# Altium schematic sheet Interface.SchDoc
size A
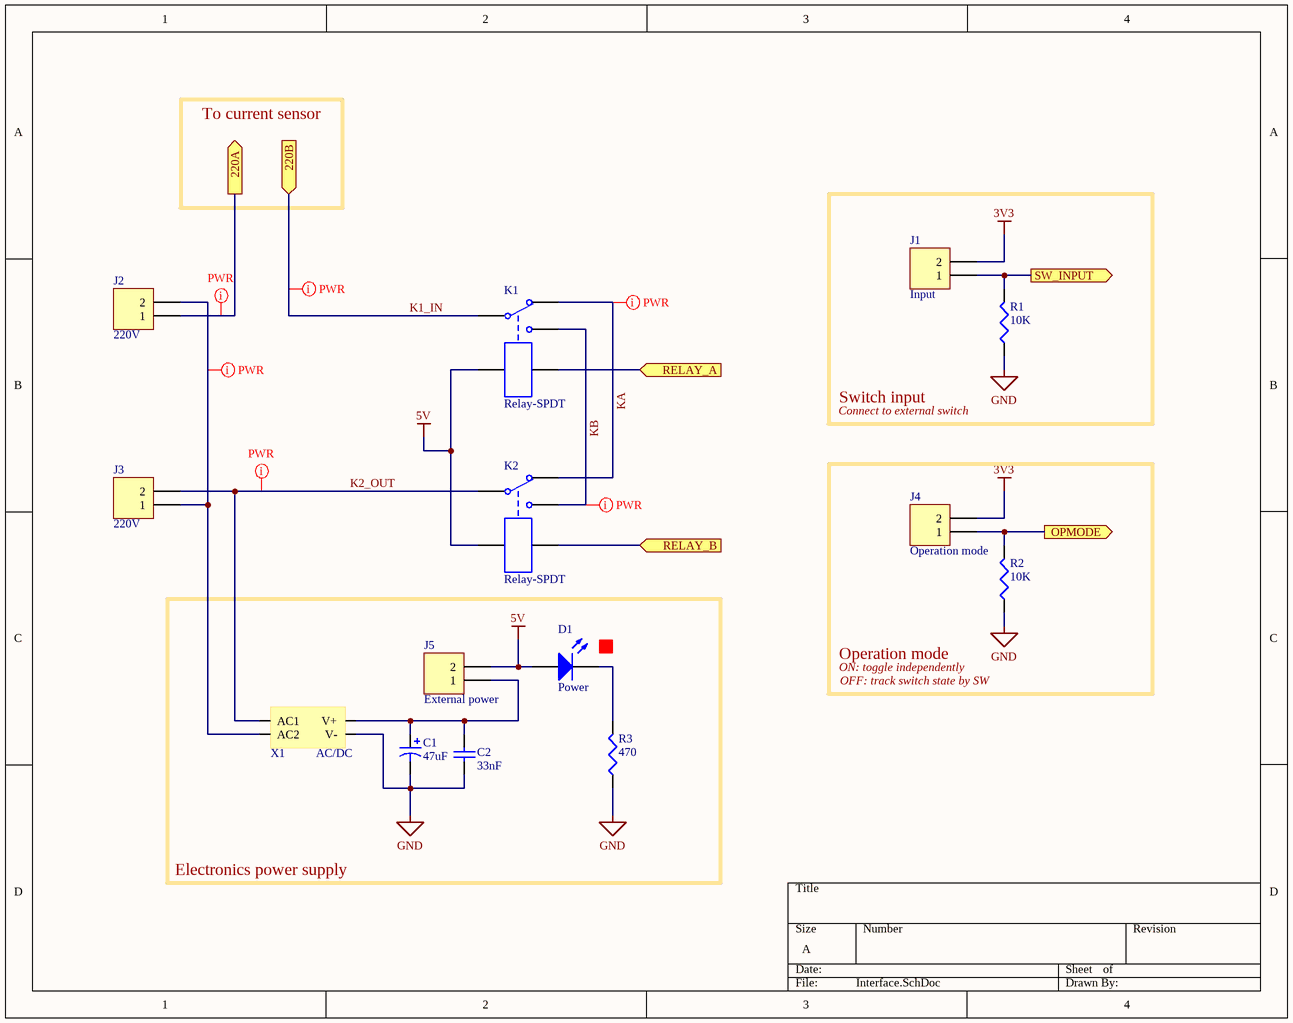
[diagram p0: Interface.SchDoc]

## Parts
C1  value 47uF  [CAP47U]  (hidden comment: Cap Pol1)
C2  value 33nF  [C0805]  (hidden comment: Cap)
D1  Power  [3.2X1.6X1.1]
J1  Input  [TBLOCK2]
J2  220V  [TBLOCK2]
J3  220V  [TBLOCK2]
J4  Operation mode  [HEADER2]
J5  External power  [HEADER2]
K1  Relay-SPDT  [G5LE-1C]
K2  Relay-SPDT  [G5LE-1C]
R1  value 10K  [J1-0603]  (hidden comment: Res3)
R2  value 10K  [J1-0603]  (hidden comment: Res3)
R3  value 470  [J1-0603]  (hidden comment: Res3)
X1  AC/DC  [HLK-PM01]

## Blocks framed on the sheet
Switch input: J1 R1
Operation mode: J4 R2
Electronics power supply: C1 C2 D1 J5 R3 X1

## Ports
220A (out), 220B (in), OPMODE (out), RELAY_A (in), RELAY_B (in), SW_INPUT (out)

## Nets
3V3: J1.2 J4.2
5V: D1.1(A) J5.2 K1.4 K2.4
GND: C1.2 C2.1 R1.1 R2.1 R3.1 X1.3(V-)
220A: J2.1 ; port 220A
K1_IN: K1.1 ; port 220B
K2_OUT: J3.2 K2.1 X1.1(AC1)
KA: K1.2 K2.2
KB: K1.3 K2.3
OPMODE: J4.1 R2.2 ; port OPMODE
RELAY_A: K1.5 ; port RELAY_A
RELAY_B: K2.5 ; port RELAY_B
SW_INPUT: J1.1 R1.2 ; port SW_INPUT
NetC1_1: C1.1 C2.2 J5.1 X1.4(V+)
NetD1_2: D1.2(K) R3.2
NetJ2_2: J2.2 J3.1 X1.2(AC2)

## Layout directives
net class power: 220A, K1_IN, K2_OUT, KA, KB, NetJ2_2

## Notes on the sheet
- To current sensor
- Connect to external switch
- ON: toggle independently
- OFF: track switch state by SW

## Library data of the parts
C1 = Cap Pol1: Polarized Capacitor (Radial); Manufacturer 1: Nichicon; Manufacturer Part Number 1: UWT1E470MCL6GS; Description 1: Aluminum Electrolytic Capacitors - SMD 25volts 47uF 6.3x5.8 20%; Dielectric Material: Aluminium; Voltage Rating: 25V; Tolerance: 20%; Ripple Current: 59mA; Leakage Current: 3uA; Life (Hours): 1000Hour; Dissipation Factor: 0.16%; Published: 8-Jun-2000; LatestRevisionDate: 17-Jul-2002; LatestRevisionNote: Re-released for DXP Platform.; PackageReference: RB7.6-15; Publisher: Altium Limited; PackageDescription: Polarized Capacitor (Radial); 2 Leads; Supplier 1: Digi-Key; Supplier Part Number 1: 493-9881-6-ND; Stock: 12722; Pricing 1: 1=0.29, 10=0.202, 100=0.1143, 500=0.08072 (USD); Mount: Surface Mount; Case/Package: Radial; Min Operating Temperature: -55°C; Max Operating Temperature: 105°C; Capacitance: 47uF; Package Quantity: 1000; Voltage Rating (DC): 25V; Packaging: Tape and Reel; Termination: SMD/SMT; Features: General Purpose; Diameter: 6.3mm; Length: 5.8mm; Height: 6.6mm; Radiation Hardening: No; Lead Free: Lead Free; ComponentLink1URL: http://www.mouser.com/ds/2/293/e-wt-30307.pdf?src-supplier=Mouser; ComponentLink1Description: http://www.mouser.com/ds/2/293/e-wt-30307.pdf?src-supplier=Mouser; ComponentLink2URL: https://www.verical.com/server-webapp/html/getDatasheet?partID=732041&src-supplier=Verical; ComponentLink2Description: https://www.verical.com/server-webapp/html/getDatasheet?partID=732041&src-supplier=Verical; ComponentLink3URL: http://www.nichicon.co.jp/english/products/pdfs/e-ch_ref.pdf?src-supplier=Digi-Key; ComponentLink3Description: http://www.nichicon.co.jp/english/products/pdfs/e-ch_ref.pdf?src-supplier=Digi-Key; ComponentLink4URL: http://nichicon-us.com/english/products/pdfs/e-wt.pdf?src-supplier=Future+Electronics; ComponentLink4Description: http://nichicon-us.com/english/products/pdfs/e-wt.pdf?src-supplier=Future+Electronics; ComponentLink5URL: http://www.nichicon.co.jp/english/products/pdfs/e-wt.pdf?src-supplier=Avnet+Europe; ComponentLink5Description: http://www.nichicon.co.jp/english/products/pdfs/e-wt.pdf?src-supplier=Avnet+Europe
C2 = Cap: Capacitor; Manufacturer 1: KEMET; Manufacturer Part Number 1: C0805C333K5RACTU; Description 1: KEMET - C0805C333K5RACTU - SMD Multilayer Ceramic Capacitor, 33000 pF, 50 V, 0805 [2012 Metric], ± 10%, X7R, C Series KEMET; Dielectric Material: Ceramic; Tolerance: 10%; Dielectric: X7R; Voltage Rating (DC): 50V; Published: 8-Jun-2000; LatestRevisionDate: 17-Jul-2002; LatestRevisionNote: Re-released for DXP Platform.; PackageReference: RAD-0.3; Publisher: Altium Limited; PackageDescription: Radial Cap, Thru-Hole; 2 Leads; 0.3 in Pin Spacing; Supplier 1: Digi-Key; Supplier Part Number 1: 399-1165-6-ND; Stock: 116403; Pricing 1: 1=0.12, 10=0.087, 100=0.0407, 500=0.02856, 1000=0.02364 (USD); Mount: Surface Mount; Case/Package: 0805; Min Operating Temperature: -55°C; Max Operating Temperature: 125°C; Capacitance: 33nF; Packaging: Tape and Reel; Voltage: 50V; Termination: SMD/SMT; Length: 2mm; Height: 0.78mm; Depth: 1.25mm; Radiation Hardening: No; ComponentLink1URL: http://www.kemet.com/kemet/web/homepage/kechome.nsf/vapubfiles/KEM_C1002_X7R_SMD.pdf/$file/KEM_C1002_X7R_SMD.pdf?src-supplier=Element14; ComponentLink1Description: http://www.kemet.com/kemet/web/homepage/kechome.nsf/vapubfiles/KEM_C1002_X7R_SMD.pdf/$file/KEM_C1002_X7R_SMD.pdf?src-supplier=Element14; ComponentLink2URL: http://www.onlinecomponents.com/productFiles/mf-KEM/kem_c1002_x7r_smd.pdf?src-supplier=Onlinecomponents.com; ComponentLink2Description: http://www.onlinecomponents.com/productFiles/mf-KEM/kem_c1002_x7r_smd.pdf?src-supplier=Onlinecomponents.com
D1 = LED2: Typical RED, GREEN, YELLOW, AMBER GaAs LED; Manufacturer 1: Stanley; Manufacturer Part Number 1: PG1101W-TR; Description 1: LED GREEN CLEAR 3216 SMD; Lens Style: Clear; Forward Voltage: 2.1V; Viewing Angle: 137°; Wavelength: 560nm; Luminous Intensity: 4.8mcd; Published: 8-Jun-2000; LatestRevisionDate: 17-Jul-2002; LatestRevisionNote: Re-released for DXP Platform.; PackageVersion: Feb-2002; PackageReference: 3.2X1.6X1.1; Publisher: Altium Limited; PackageDescription: SM LED; 2 Flat Leads; Supplier 1: Digi-Key; Supplier Part Number 1: 404-1046-6-ND; Stock: 64799; Pricing 1: 1=0.45, 10=0.316, 100=0.1841, 500=0.12624, 1000=0.1052 (USD); Mount: Surface Mount; Case/Package: 1206; Color: Green; Packaging: Cut Tape; Length: 3mm; Height: 1.5mm; Width: 1.5mm; Lead Free: Lead Free; ComponentLink1URL: http://www1.futureelectronics.com/doc/STANLEY/PG1101W-TR.pdf?src-supplier=Future+Electronics; ComponentLink1Description: http://www1.futureelectronics.com/doc/STANLEY/PG1101W-TR.pdf?src-supplier=Future+Electronics
J1-J3 = Header 2: Header, 2-Pin; Manufacturer 1: TE Connectivity; Manufacturer Part Number 1: 282834-2; Description 1: TE CONNECTIVITY / BUCHANAN - 282834-2 - TERMINAL BLOCK, WIRE TO BRD, 2POS, 16AWG; Plating: Brass,Steel; Max Voltage Rating (AC): 150V; Number of Poles: 2; Gender: Male; Current Rating: 10A; Number of Levels: 1; Connector Type: Receptacle; Closed End: No (Without); Screwless Terminal Block: Yes (With); Wire Gauge (Max): 30AWG; Pitch: 2.54mm; Thread Size: M1.6; Tail Length: 3.4mm; Approvals: UL; LatestRevisionDate: 17-Jul-2002; LatestRevisionNote: Re-released for DXP Platform.; Publisher: Altium Limited; Supplier 1: Digi-Key; Supplier Part Number 1: A98333-ND; Stock: 18918; Pricing 1: 1=0.92, 10=0.649, 25=0.6048, 50=0.549, 100=0.5467, 250=0.46164, 500=0.43732, 1000=0.38874, 5000=0.36444 (USD); Mount: Through Hole; Contact Plating: Tin; Contact Material: Brass; Color: Green; Material: Nylon; Housing Color: Green; Housing Material: Polyamide; Min Operating Temperature: -40°C; Max Operating Temperature: 105°C; Number of Rows: 1; Voltage Rating: 150V; Package Quantity: 300; Packaging: Bulk; Number of Positions: 2; Termination: Solder; Number of Positions Per Level: 2; Current: 10A; Voltage: 150V; Max Supply Voltage (AC): 150V; Number of Contacts: 2; Number of Circuits: 2; Orientation: Straight; Max Current Rating: 10A; Interlock: No (Without); Screw Flange: No (Without); Side Stackable: Yes (With); Length: 5.54mm; Wire Gauge (Min): 30AWG; Width: 6.5mm; Wire/Cable Gauge: 30AWG; Depth: 6.5mm; Radiation Hardening: No; REACH SVHC: Unknown; ELV: Compliant; Lead Free: Lead Free; Flammability Rating: UL94 V-0; ComponentLink1URL: https://www.alliedelec.com/m/d/020b790adaa0bc8636bbfa0190e2b719.pdf?src-supplier=Allied+Electronics; ComponentLink1Description: https://www.alliedelec.com/m/d/020b790adaa0bc8636bbfa0190e2b719.pdf?src-supplier=Allied+Electronics; ComponentLink2URL: https://www.verical.com/server-webapp/html/getDatasheet?partID=155864&src-supplier=Verical; ComponentLink2Description: https://www.verical.com/server-webapp/html/getDatasheet?partID=155864&src-supplier=Verical; ComponentLink3URL: http://www.te.com/commerce/DocumentDelivery/DDEController?Action=showdoc&DocId=Catalog+Section%7F1308389_EUROSTYLE_TERMINAL_BLOCKS%7F0607%7Fpdf%7FEnglish%7FENG_CS_1308389_EUROSTYLE_TERMINAL_BLOCKS_0607.pdf&src-supplier=Avnet; ComponentLink3Description: http://www.te.com/commerce/DocumentDelivery/DDEController?Action=showdoc&DocId=Catalog+Section%7F1308389_EUROSTYLE_TERMINAL_BLOCKS%7F0607%7Fpdf%7FEnglish%7FENG_CS_1308389_EUROSTYLE_TERMINAL_BLOCKS_0607.pdf&src-supplier=Avnet; ComponentLink4URL: http://www1.futureelectronics.com/doc/TE%20CONNECTIVITY/282834-2.pdf?src-supplier=Future+Electronics; ComponentLink4Description: http://www1.futureelectronics.com/doc/TE%20CONNECTIVITY/282834-2.pdf?src-supplier=Future+Electronics; ComponentLink5URL: https://www.te.com/commerce/DocumentDelivery/DDEController?Action=srchrtrv&DocNm=1308389_EUROSTYLE_TERMINAL_BLOCKS&DocType=CS&DocLang=English&src-supplier=Digi-Key; ComponentLink5Description: https://www.te.com/commerce/DocumentDelivery/DDEController?Action=srchrtrv&DocNm=1308389_EUROSTYLE_TERMINAL_BLOCKS&DocType=CS&DocLang=English&src-supplier=Digi-Key; ComponentLink6URL: http://www.te.com/commerce/DocumentDelivery/DDEController?Action=showdoc&DocId=Catalog+Section%7F1308389_EUROSTYLE_TERMINAL_BLOCKS%7F0607%7Fpdf%7FEnglish%7FENG_CS_1308389_EUROSTYLE_TERMINAL_BLOCKS_0607.pdf&src-supplier=Avnet+Europe; ComponentLink6Description: http://www.te.com/commerce/DocumentDelivery/DDEController?Action=showdoc&DocId=Catalog+Section%7F1308389_EUROSTYLE_TERMINAL_BLOCKS%7F0607%7Fpdf%7FEnglish%7FENG_CS_1308389_EUROSTYLE_TERMINAL_BLOCKS_0607.pdf&src-supplier=Avnet+Europe; ComponentLink7URL: http://www.onlinecomponents.com/productFiles/mf-AMP/eng_cs_1308389_eurostyle_terminal_blocks_0607.pdf?src-supplier=Onlinecomponents.com; ComponentLink7Description: http://www.onlinecomponents.com/productFiles/mf-AMP/eng_cs_1308389_eurostyle_terminal_blocks_0607.pdf?src-supplier=Onlinecomponents.com
J4 J5 = Header 2: Header, 2-Pin; Manufacturer 1: Amphenol FCI; Manufacturer Part Number 1: 77311-118-02LF; Description 1: Conn;  Rect;  UnshroudedHdr;  2Cnts;  ThruHole;  BergStik;  2.54mmPin-Spng;  Vert;  SingleRow; Current Rating: 3A; Voltage Rating: 1.5kV; Number of Positions: 2; Insulation Resistance: 5GR; Gender: Male; Connector Type: Male Pin; Pitch: 2.54mm; Contact Post Length: 3.05mm; LatestRevisionDate: 17-Jul-2002; LatestRevisionNote: Re-released for DXP Platform.; Publisher: Altium Limited; Supplier 1: Digi-Key; Supplier Part Number 1: 609-4434-ND; Stock: 85355; Pricing 1: 1=0.19, 10=0.182, 100=0.1258, 500=0.10648, 1000=0.08712, 5000=0.07744, 10000=0.07018 (USD); Mount: Through Hole; Contact Plating: Gold,GXT; Contact Material: Bronze; Color: Black; Housing Color: Black; Material: Thermoplastic; Housing Material: Thermoplastic; Min Operating Temperature: -65°C; Max Operating Temperature: 125°C; Number of Rows: 1; Contact Gender: Male; Package Quantity: 1000; Packaging: Bulk; Termination: Solder; Number of Contacts: 2; Max Voltage Rating (AC): 1.5kV; Orientation: Straight; Length: 5.08mm; Contact Mating Length: 0.23inch; Depth: 2.4mm; Radiation Hardening: No; REACH SVHC: No SVHC; Lead Free: Lead Free; Flammability Rating: UL94 V-0; ComponentLink1URL: https://cdn.amphenol-icc.com/media/wysiwyg/files/drawing/77311.pdf?src-supplier=Digi-Key; ComponentLink1Description: https://cdn.amphenol-icc.com/media/wysiwyg/files/drawing/77311.pdf?src-supplier=Digi-Key; ComponentLink2URL: http://portal.fciconnect.com/Comergent/fci/drawing/77311.pdf?src-supplier=Avnet+Asia; ComponentLink2Description: http://portal.fciconnect.com/Comergent/fci/drawing/77311.pdf?src-supplier=Avnet+Asia; ComponentLink3URL: http://portal.fciconnect.com/Comergent/fci/drawing/77311.pdf?src-supplier=Avnet; ComponentLink3Description: http://portal.fciconnect.com/Comergent/fci/drawing/77311.pdf?src-supplier=Avnet; ComponentLink4URL: https://www.alliedelec.com/m/d/695616ca3fa695a35268331f95f01020.pdf?src-supplier=Allied+Electronics; ComponentLink4Description: https://www.alliedelec.com/m/d/695616ca3fa695a35268331f95f01020.pdf?src-supplier=Allied+Electronics
K1 K2 = Relay-SPDT: Single-Pole Dual-Throw Relay; Manufacturer 1: Omron; Manufacturer Part Number 1: G5LE-14-DC3; Description 1: RELAY GEN PURPOSE SPDT 10A 3V; Throw Configuration: SPDT; Coil Resistance: 22.5R; Coil Current: 133mA; Operate Time: 10ms; Release Time: 5ms; Coil Power: 400mW; Max Voltage Rating (AC): 250V; Max Voltage Rating (DC): 125V; Relay Type: General Purpose; Coil Type: Non-Latching; Coil Voltage (DC): 3V; Contact Current Rating: 10A; Published: 24-Mar-1999; LatestRevisionDate: 17-Jul-2002; LatestRevisionNote: Re-released for DXP Platform.; PackageReference: MODULE5B; Publisher: Altium Limited; Supplier 1: Digi-Key; Supplier Part Number 1: Z3326-ND; Stock: 12824; Pricing 1: 1=1.44, 10=1.35, 25=1.2004, 50=1.1404, 100=1.0804, 250=0.96032, 500=0.9003, 1000=0.84028, 5000=0.81027 (USD); Mount: Through Hole; Number of Pins: 5; Weight: 12g; Contact Material: Tin,Silver; Min Operating Temperature: -25°C; Max Operating Temperature: 85°C; Package Quantity: 500; Packaging: Tray; Termination: PC Pin; Max Current Rating: 10A; Radiation Hardening: No; ComponentLink1URL: https://omronfs.omron.com/en_US/ecb/products/pdf/en-g5le.pdf?src-supplier=Digi-Key; ComponentLink1Description: https://omronfs.omron.com/en_US/ecb/products/pdf/en-g5le.pdf?src-supplier=Digi-Key
R1 R2 = Res3: Resistor; Manufacturer 1: Panasonic; Manufacturer Part Number 1: ERJ-3GEYJ103V; Description 1: Res Thick Film 0603 10K Ohm 5% 1/10W ±200ppm/°C Molded SMD Punched Carrier T/R; Resistance: 10kR; Tolerance: 5%; Power Rating: 100mW; Voltage Rating: 75V; Temperature Coefficient: 200ppm/°C; Voltage Rating (DC): 50V; Published: 8-Jun-2000; LatestRevisionDate: 29-May-2009; LatestRevisionNote: IPC-7351 Footprint Added.; PackageReference: J1-0603; Publisher: Altium Limited; PackageDescription: Chip Resistor; Supplier 1: Digi-Key; Supplier Part Number 1: P10KGDKR-ND; Stock: 22255773; Pricing 1: 1=0.1, 10=0.038, 100=0.0156, 1000=0.007, 2500=0.00607 (USD); Mount: Surface Mount; Case/Package: 0603; Weight: 7.1E-05oz; Case Code (Imperial): 0603; Case Code (Metric): 1608; Contact Plating: Tin; Min Operating Temperature: -55°C; Max Operating Temperature: 155°C; Packaging: Tape and Reel; Package Quantity: 1; Composition: Thick Film; Termination: SMD/SMT; Number of Terminations: 2; Military Standard: Not; Max Power Dissipation: 100mW; Working Voltage: 75V; Features: Automotive AEC-Q200; Length: 1.6mm; Height: 0.45mm; Width: 0.8mm; Depth: 0.8mm; REACH SVHC: No SVHC; Lead Free: Lead Free; ComponentLink1URL: http://www.farnell.com/datasheets/2059623.pdf?src-supplier=Element14; ComponentLink1Description: http://www.farnell.com/datasheets/2059623.pdf?src-supplier=Element14; ComponentLink2URL: http://industrial.panasonic.com/www-cgi/jvcr13pz.cgi?E+PZ+3+AOA0002+ERJ1GNJ120C+7+WW?src-supplier=Mouser; ComponentLink2Description: http://industrial.panasonic.com/www-cgi/jvcr13pz.cgi?E+PZ+3+AOA0002+ERJ1GNJ120C+7+WW?src-supplier=Mouser; ComponentLink3URL: http://industrial.panasonic.com/www-data/pdf/AOA0000/AOA0000CE1.pdf?src-supplier=Avnet+Europe; ComponentLink3Description: http://industrial.panasonic.com/www-data/pdf/AOA0000/AOA0000CE1.pdf?src-supplier=Avnet+Europe; ComponentLink4URL: http://www.jameco.com/Jameco/Products/ProdDS/2007265.pdf?src-supplier=Jameco; ComponentLink4Description: http://www.jameco.com/Jameco/Products/ProdDS/2007265.pdf?src-supplier=Jameco; ComponentLink5URL: http://industrial.panasonic.com/www-data/pdf/AOA0000/AOA0000CE1.pdf?src-supplier=Avnet; ComponentLink5Description: http://industrial.panasonic.com/www-data/pdf/AOA0000/AOA0000CE1.pdf?src-supplier=Avnet; ComponentLink6URL: https://industrial.panasonic.com/cdbs/www-data/pdf/RDA0000/AOA0000C301.pdf?src-supplier=Future+Electronics; ComponentLink6Description: https://industrial.panasonic.com/cdbs/www-data/pdf/RDA0000/AOA0000C301.pdf?src-supplier=Future+Electronics
R3 = Res3: Resistor; Manufacturer 1: TE Connectivity; Manufacturer Part Number 1: CRGCQ0603J470R; Description 1: TE CONNECTIVITY - CRGCQ0603J470R - RES, 470R, 5%, 0603, THICK FILM; Resistance: 470R; Tolerance: 5%; Max Power Dissipation: 100mW; Temperature Coefficient: 100ppm/°C; Published: 8-Jun-2000; LatestRevisionDate: 29-May-2009; LatestRevisionNote: IPC-7351 Footprint Added.; PackageReference: J1-0603; Publisher: Altium Limited; PackageDescription: Chip Resistor; Supplier 1: Digi-Key; Supplier Part Number 1: A130089DKR-ND; Stock: 87954; Pricing 1: 1=0.1, 10=0.021, 100=0.0086, 1000=0.00387, 2500=0.00336 (USD); Case/Package: 0603; Case Code (Imperial): 0603; Case Code (Metric): 1608; Min Operating Temperature: -55°C; Max Operating Temperature: 155°C; Composition: Thick Film; Features: Moisture Resistant,Automotive AEC-Q200; Packaging: Tape and Reel; Number of Terminations: 2; ComponentLink1URL: https://4donline.ihs.com/images/VipMasterIC/IC/TYEL/TYEL-S-A0004929575/TYEL-S-A0004929575-1.pdf?hkey=52A5661711E402568146F3353EA87419&src-supplier=Farnell; ComponentLink1Description: https://4donline.ihs.com/images/VipMasterIC/IC/TYEL/TYEL-S-A0004929575/TYEL-S-A0004929575-1.pdf?hkey=52A5661711E402568146F3353EA87419&src-supplier=Farnell; ComponentLink2URL: https://4donline.ihs.com/images/VipMasterIC/IC/TYEL/TYEL-S-A0004929575/TYEL-S-A0004929575-1.pdf?hkey=52A5661711E402568146F3353EA87419&src-supplier=Newark; ComponentLink2Description: https://4donline.ihs.com/images/VipMasterIC/IC/TYEL/TYEL-S-A0004929575/TYEL-S-A0004929575-1.pdf?hkey=52A5661711E402568146F3353EA87419&src-supplier=Newark; ComponentLink3URL: https://www.te.com/commerce/DocumentDelivery/DDEController?Action=srchrtrv&amp;DocNm=1773204-3&amp;DocType=DS&amp;DocLang=English&src-supplier=Digi-Key; ComponentLink3Description: https://www.te.com/commerce/DocumentDelivery/DDEController?Action=srchrtrv&amp;DocNm=1773204-3&amp;DocType=DS&amp;DocLang=English&src-supplier=Digi-Key; ComponentLink4URL: https://www.te.com/commerce/DocumentDelivery/DDEController?Action=srchrtrv&DocNm=1773204-3&DocType=DS&DocLang=English&src-supplier=Digi-Key; ComponentLink4Description: https://www.te.com/commerce/DocumentDelivery/DDEController?Action=srchrtrv&DocNm=1773204-3&DocType=DS&DocLang=English&src-supplier=Digi-Key
X1 = HLK-PM01: 220Vac to 5Vdc converter (3W); Manufacturer 1: Hi-Link; Manufacturer Part Number 1: PM01; ComponentLink1Description: Datasheet; ComponentLink1URL: https://datasheet.lcsc.com/szlcsc/1909111105_HI-LINK-HLK-PM24_C399250.pdf